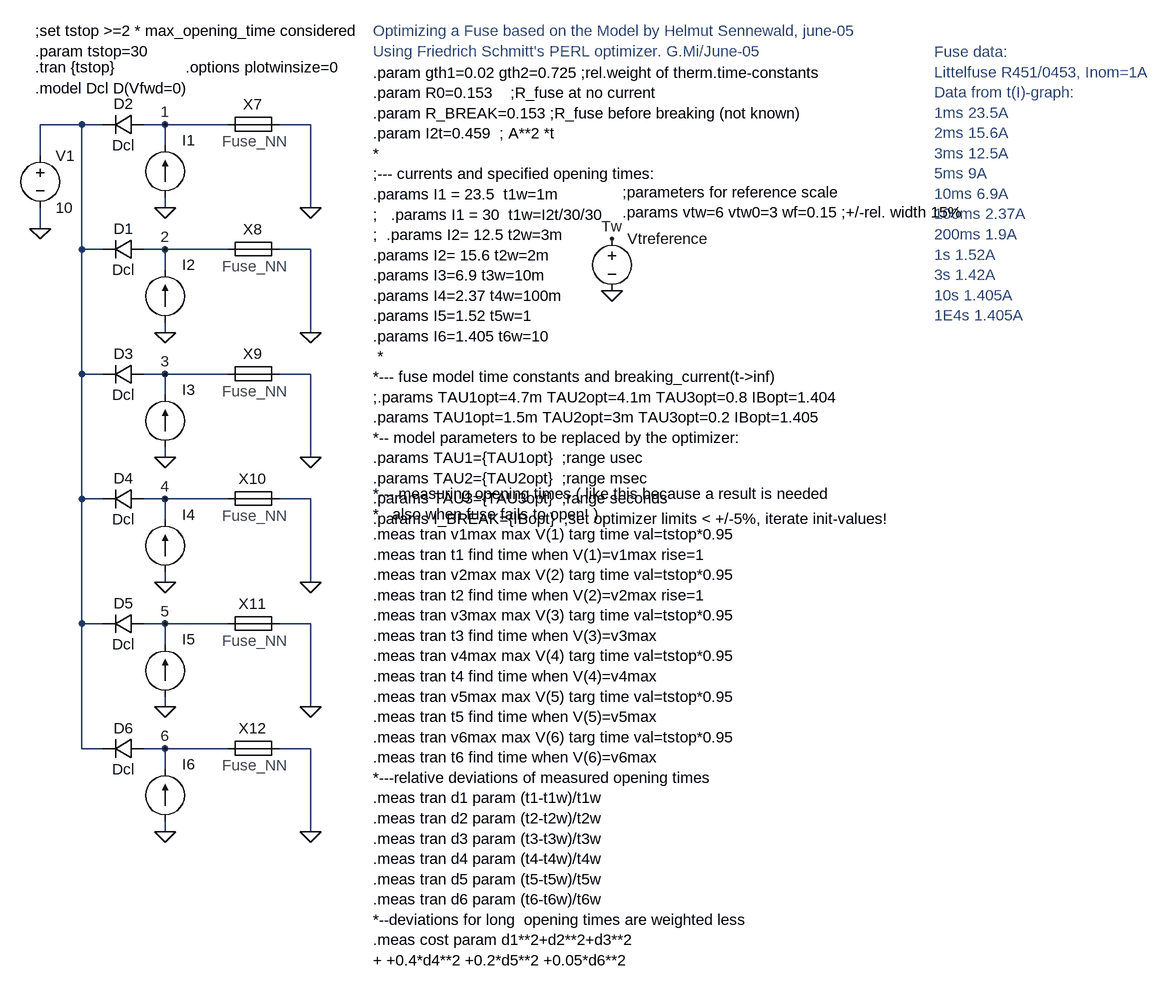
[diagram p0: schematic Fuse_FIT.asc]
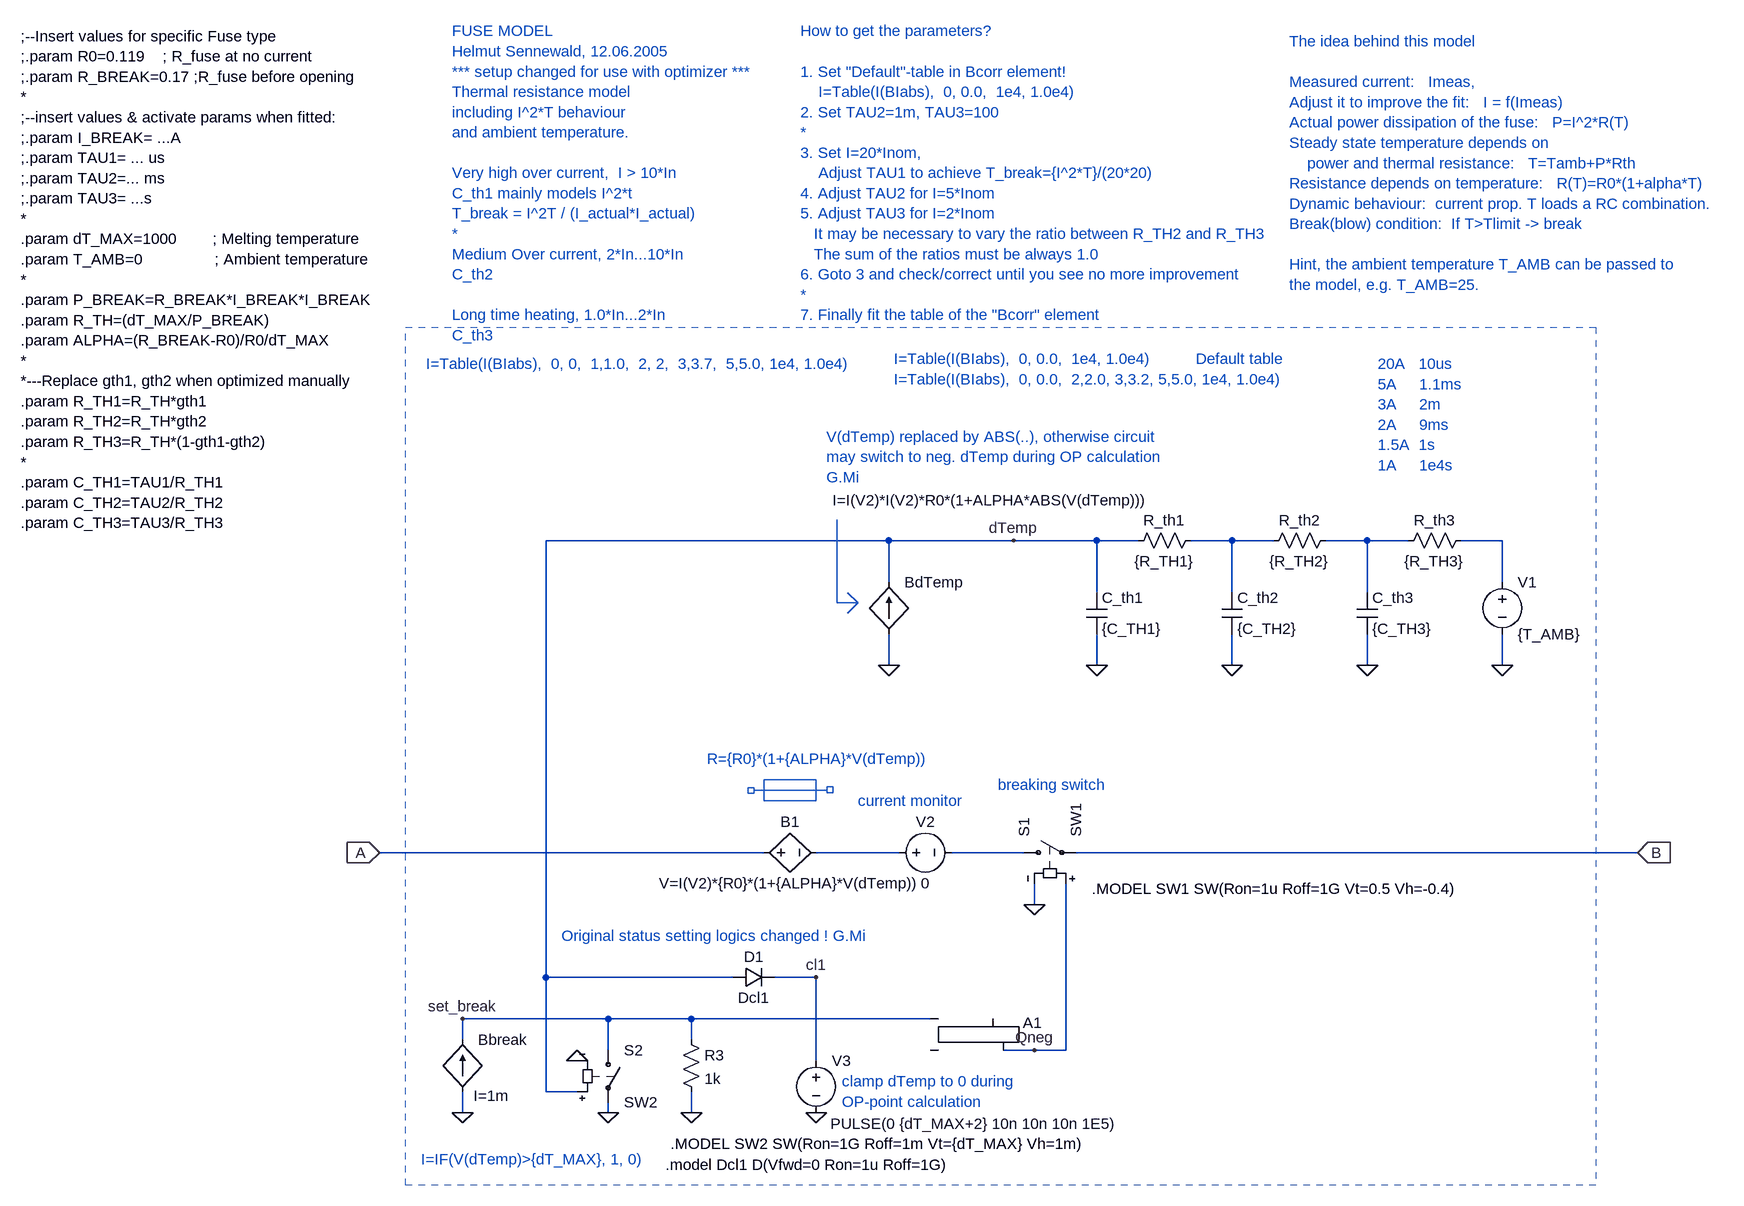
[diagram p1: sub-circuit fuse_model_nn.asc]
Fuse_FIT.asc, the LTspice schematic file:
Version 4
SHEET 1 3648 932
WIRE -384 -752 -448 -752
WIRE -352 -752 -384 -752
WIRE -256 -752 -288 -752
WIRE -160 -752 -256 -752
WIRE -32 -752 -80 -752
WIRE -256 -720 -256 -752
WIRE -448 -704 -448 -752
WIRE -256 -624 -256 -640
WIRE -32 -624 -32 -752
WIRE -448 -592 -448 -624
WIRE -384 -560 -384 -752
WIRE -352 -560 -384 -560
WIRE -256 -560 -288 -560
WIRE -160 -560 -256 -560
WIRE -32 -560 -80 -560
WIRE -256 -528 -256 -560
WIRE -256 -432 -256 -448
WIRE -32 -432 -32 -560
WIRE -384 -368 -384 -560
WIRE -352 -368 -384 -368
WIRE -256 -368 -288 -368
WIRE -160 -368 -256 -368
WIRE -32 -368 -80 -368
WIRE -256 -336 -256 -368
WIRE -256 -240 -256 -256
WIRE -32 -240 -32 -368
WIRE -384 -176 -384 -368
WIRE -352 -176 -384 -176
WIRE -256 -176 -288 -176
WIRE -160 -176 -256 -176
WIRE -32 -176 -80 -176
WIRE -256 -144 -256 -176
WIRE -256 -48 -256 -64
WIRE -32 -48 -32 -176
WIRE -384 16 -384 -176
WIRE -352 16 -384 16
WIRE -256 16 -288 16
WIRE -160 16 -256 16
WIRE -32 16 -80 16
WIRE -256 48 -256 16
WIRE -256 144 -256 128
WIRE -32 144 -32 16
WIRE -384 208 -384 16
WIRE -352 208 -384 208
WIRE -256 208 -288 208
WIRE -160 208 -256 208
WIRE -32 208 -80 208
WIRE -256 240 -256 208
WIRE -256 336 -256 320
WIRE -32 336 -32 208
FLAG -256 -624 0
FLAG -256 -752 1
FLAG -32 -624 0
FLAG -448 -592 0
FLAG -256 -432 0
FLAG -256 -560 2
FLAG -32 -432 0
FLAG -256 -240 0
FLAG -256 -368 3
FLAG -32 -240 0
FLAG -256 -48 0
FLAG -256 -176 4
FLAG -32 -48 0
FLAG -256 144 0
FLAG -256 16 5
FLAG -32 144 0
FLAG -256 336 0
FLAG -256 208 6
FLAG -32 336 0
FLAG 432 -496 0
FLAG 432 -576 Tw
SYMBOL diode -288 -768 R90
WINDOW 0 0 32 VBottom 0
WINDOW 3 32 32 VTop 0
SYMATTR InstName D2
SYMATTR Value Dcl
SYMBOL voltage -448 -720 R0
WINDOW 123 0 0 Left 0
WINDOW 39 0 0 Left 0
SYMATTR InstName V1
SYMATTR Value 10
SYMBOL Fuse_Model_NN -128 -752 R0
SYMATTR InstName X7
SYMBOL Fuse_Model_NN -128 -560 R0
SYMATTR InstName X8
SYMBOL Fuse_Model_NN -128 -368 R0
SYMATTR InstName X9
SYMBOL Fuse_Model_NN -128 -176 R0
SYMATTR InstName X10
SYMBOL Fuse_Model_NN -128 16 R0
SYMATTR InstName X11
SYMBOL Fuse_Model_NN -128 208 R0
SYMATTR InstName X12
SYMBOL diode -288 -576 R90
WINDOW 0 0 32 VBottom 0
WINDOW 3 32 32 VTop 0
SYMATTR InstName D1
SYMATTR Value Dcl
SYMBOL diode -288 -384 R90
WINDOW 0 0 32 VBottom 0
WINDOW 3 32 32 VTop 0
SYMATTR InstName D3
SYMATTR Value Dcl
SYMBOL diode -288 -192 R90
WINDOW 0 0 32 VBottom 0
WINDOW 3 32 32 VTop 0
SYMATTR InstName D4
SYMATTR Value Dcl
SYMBOL diode -288 0 R90
WINDOW 0 0 32 VBottom 0
WINDOW 3 32 32 VTop 0
SYMATTR InstName D5
SYMATTR Value Dcl
SYMBOL diode -288 192 R90
WINDOW 0 0 32 VBottom 0
WINDOW 3 32 32 VTop 0
SYMATTR InstName D6
SYMATTR Value Dcl
SYMBOL voltage 432 -592 R0
WINDOW 3 26 87 Invisible 0
WINDOW 123 0 0 Left 0
WINDOW 39 0 0 Left 0
SYMATTR Value PWL(0 {vtw0} {t1w-t1w*wf} {vtw0} {t1w} {vtw} {t1w+t1w*wf} {vtw0} {t2w-t2w*wf} {vtw0} {t2w} {vtw} {t2w+t2w*wf} {vtw0} {t3w-t3w*wf} {vtw0} {t3w} {vtw} {t3w+t3w*wf} {vtw0} {t4w-t4w*wf} {vtw0} {t4w} {vtw} {t4w+t4w*wf} {vtw0} {t5w-t5w*wf} {vtw0} {t5w} {vtw} {t5w+t5w*wf} {vtw0} {t6w-t6w*wf} {vtw0} {t6w} {vtw} {t6w+t6w*wf} {vtw0})
SYMATTR InstName Vtreference
SYMBOL current -256 -448 R180
WINDOW 0 -47 88 Left 0
WINDOW 3 -82 39 Invisible 0
WINDOW 123 0 0 Left 0
WINDOW 39 0 0 Left 0
SYMATTR InstName I2
SYMATTR Value {I2}
SYMBOL current -256 -256 R180
WINDOW 0 -47 88 Left 0
WINDOW 3 -82 39 Invisible 0
WINDOW 123 0 0 Left 0
WINDOW 39 0 0 Left 0
SYMATTR InstName I3
SYMATTR Value {I3}
SYMBOL current -256 -64 R180
WINDOW 0 -47 88 Left 0
WINDOW 3 -82 39 Invisible 0
WINDOW 123 0 0 Left 0
WINDOW 39 0 0 Left 0
SYMATTR InstName I4
SYMATTR Value {I4}
SYMBOL current -256 128 R180
WINDOW 0 -47 88 Left 0
WINDOW 3 -82 39 Invisible 0
WINDOW 123 0 0 Left 0
WINDOW 39 0 0 Left 0
SYMATTR InstName I5
SYMATTR Value {I5}
SYMBOL current -256 320 R180
WINDOW 0 -47 88 Left 0
WINDOW 3 -82 39 Invisible 0
WINDOW 123 0 0 Left 0
WINDOW 39 0 0 Left 0
SYMATTR InstName I6
SYMATTR Value PULSE(0 {I6} 0 1n 1n 1E6)
SYMBOL current -256 -640 R180
WINDOW 0 -47 88 Left 0
WINDOW 3 -82 39 Invisible 0
WINDOW 123 0 0 Left 0
WINDOW 39 0 0 Left 0
SYMATTR InstName I1
SYMATTR Value {I1}
TEXT -456 -840 Left 0 !.tran {tstop}
TEXT -224 -840 Left 0 !.options plotwinsize=0
TEXT 64 -832 Left 0 !.param gth1=0.02 gth2=0.725 ;rel.weight of therm.time-constants\n.param R0=0.153    ;R_fuse at no current\n.param R_BREAK=0.153 ;R_fuse before breaking (not known)\n.param I2t=0.459  ; A**2 *t\n*\n;--- currents and specified opening times:\n.params I1 = 23.5  t1w=1m\n;   .params I1 = 30  t1w=I2t/30/30\n;  .params I2= 12.5 t2w=3m\n.params I2= 15.6 t2w=2m\n.params I3=6.9 t3w=10m\n.params I4=2.37 t4w=100m\n.params I5=1.52 t5w=1\n.params I6=1.405 t6w=10\n *\n*--- fuse model time constants and breaking_current(t->inf)\n;.params TAU1opt=4.7m TAU2opt=4.1m TAU3opt=0.8 IBopt=1.404\n.params TAU1opt=1.5m TAU2opt=3m TAU3opt=0.2 IBopt=1.405\n*-- model parameters to be replaced by the optimizer:\n.params TAU1={TAU1opt}  ;range usec\n.params TAU2={TAU2opt}  ;range msec\n.params TAU3={TAU3opt}  ;range seconds\n.params I_BREAK={IBopt}  ;set optimizer limits < +/-5%, iterate init-values!
TEXT 64 -184 Left 0 !*--- measuring opening times ( like this because a result is needed\n*   also when fuse fails to open! )\n.meas tran v1max max V(1) targ time val=tstop*0.95\n.meas tran t1 find time when V(1)=v1max rise=1\n.meas tran v2max max V(2) targ time val=tstop*0.95\n.meas tran t2 find time when V(2)=v2max rise=1\n.meas tran v3max max V(3) targ time val=tstop*0.95\n.meas tran t3 find time when V(3)=v3max\n.meas tran v4max max V(4) targ time val=tstop*0.95\n.meas tran t4 find time when V(4)=v4max\n.meas tran v5max max V(5) targ time val=tstop*0.95\n.meas tran t5 find time when V(5)=v5max\n.meas tran v6max max V(6) targ time val=tstop*0.95\n.meas tran t6 find time when V(6)=v6max\n*---relative deviations of measured opening times\n.meas tran d1 param (t1-t1w)/t1w\n.meas tran d2 param (t2-t2w)/t2w\n.meas tran d3 param (t3-t3w)/t3w\n.meas tran d4 param (t4-t4w)/t4w\n.meas tran d5 param (t5-t5w)/t5w\n.meas tran d6 param (t6-t6w)/t6w\n*--deviations for long  opening times are weighted less\n.meas cost param d1**2+d2**2+d3**2\n+ +0.4*d4**2 +0.2*d5**2 +0.05*d6**2
TEXT -456 -808 Left 0 !.model Dcl D(Vfwd=0)
TEXT -456 -896 Left 0 !;set tstop >=2 * max_opening_time considered\n.param tstop=30
TEXT 928 -864 Left 0 ;Fuse data:\nLittelfuse R451/0453, Inom=1A\nData from t(I)-graph:\n1ms 23.5A\n2ms 15.6A\n3ms 12.5A\n5ms 9A\n10ms 6.9A\n100ms 2.37A\n200ms 1.9A\n1s 1.52A\n3s 1.42A\n10s 1.405A\n1E4s 1.405A
TEXT 64 -896 Left 0 ;Optimizing a Fuse based on the Model by Helmut Sennewald, june-05\nUsing Friedrich Schmitt's PERL optimizer. G.Mi/June-05
TEXT 448 -648 Left 0 !;parameters for reference scale\n.params vtw=6 vtw0=3 wf=0.15 ;+/-rel. width 15%

fuse_model_nn.asc, the sub-circuit schematic file:
Version 4
SHEET 1 2036 932
WIRE -96 368 -96 336
WIRE -96 480 -96 448
WIRE 32 272 32 -400
WIRE 32 448 32 272
WIRE 80 448 32 448
WIRE 128 336 -96 336
WIRE 128 384 128 336
WIRE 128 480 128 464
WIRE 256 336 128 336
WIRE 256 368 256 336
WIRE 256 480 256 448
WIRE 320 272 32 272
WIRE 368 80 -224 80
WIRE 448 272 384 272
WIRE 448 400 448 272
WIRE 560 -400 32 -400
WIRE 560 -336 560 -400
WIRE 560 -208 560 -256
WIRE 576 80 448 80
WIRE 624 336 256 336
WIRE 752 -400 560 -400
WIRE 768 80 656 80
WIRE 784 160 784 128
WIRE 784 384 736 384
WIRE 832 384 784 384
WIRE 832 384 832 128
WIRE 880 -400 752 -400
WIRE 880 -320 880 -400
WIRE 880 -208 880 -256
WIRE 944 -400 880 -400
WIRE 1088 -400 1024 -400
WIRE 1088 -320 1088 -400
WIRE 1088 -208 1088 -256
WIRE 1152 -400 1088 -400
WIRE 1296 -400 1232 -400
WIRE 1296 -320 1296 -400
WIRE 1296 -208 1296 -256
WIRE 1360 -400 1296 -400
WIRE 1504 -400 1440 -400
WIRE 1504 -336 1504 -400
WIRE 1504 -208 1504 -256
WIRE 1712 80 848 80
FLAG 560 -208 0
FLAG 784 160 0
FLAG 752 -400 dTemp
FLAG 880 -208 0
FLAG 1296 -208 0
FLAG 1088 -208 0
FLAG -96 480 0
FLAG 256 480 0
FLAG -96 336 set_break
FLAG 1504 -208 0
FLAG -224 80 A
IOPIN -224 80 In
FLAG 1712 80 B
IOPIN 1712 80 In
FLAG 784 384 Qneg
FLAG 128 480 0
FLAG 448 480 0
FLAG 80 400 0
FLAG 448 272 cl1
SYMBOL voltage 560 80 R270
WINDOW 0 32 56 VTop 0
WINDOW 3 -32 56 VBottom 0
SYMATTR InstName V2
SYMATTR Value 0
SYMBOL bi2 560 -336 R0
WINDOW 3 -87 -126 Left 0
SYMATTR Value I=I(V2)*I(V2)*R0*(1+ALPHA*ABS(V(dTemp)))
SYMATTR InstName BdTemp
SYMBOL res 928 -384 R270
WINDOW 0 32 56 VTop 0
WINDOW 3 0 56 VBottom 0
SYMATTR InstName R_th1
SYMATTR Value {R_TH1}
SYMBOL cap 864 -320 R0
SYMATTR InstName C_th1
SYMATTR Value {C_TH1}
SYMBOL sw 752 80 R270
SYMATTR InstName S1
SYMATTR Value SW1
SYMBOL res 1136 -384 R270
WINDOW 0 32 56 VTop 0
WINDOW 3 0 56 VBottom 0
SYMATTR InstName R_th2
SYMATTR Value {R_TH2}
SYMBOL cap 1072 -320 R0
SYMATTR InstName C_th2
SYMATTR Value {C_TH2}
SYMBOL Digital\\srflop 672 288 R0
SYMATTR InstName A1
SYMBOL cap 1280 -320 R0
SYMATTR InstName C_th3
SYMATTR Value {C_TH3}
SYMBOL bi2 -96 368 R0
WINDOW 3 17 86 Left 0
SYMATTR Value I=1m
SYMATTR InstName Bbreak
SYMBOL res 240 352 R0
SYMATTR InstName R3
SYMATTR Value 1k
SYMBOL res 1344 -384 R270
WINDOW 0 32 56 VTop 0
WINDOW 3 0 56 VBottom 0
SYMATTR InstName R_th3
SYMATTR Value {R_TH3}
SYMBOL bv 352 80 R270
WINDOW 0 32 56 VTop 0
WINDOW 3 -32 56 VBottom 0
SYMATTR InstName B1
SYMATTR Value V=I(V2)*{R0}*(1+{ALPHA}*V(dTemp))
SYMBOL voltage 1504 -352 R0
SYMATTR InstName V1
SYMATTR Value {T_AMB}
SYMBOL sw 128 368 R0
SYMATTR InstName S2
SYMATTR Value SW2
SYMBOL voltage 448 384 R0
WINDOW 123 0 0 Left 0
WINDOW 39 0 0 Left 0
WINDOW 3 22 113 Left 0
SYMATTR Value PULSE(0 {dT_MAX+2} 10n 10n 10n 1E5)
SYMATTR InstName V3
SYMBOL diode 320 288 R270
WINDOW 0 32 32 VTop 0
WINDOW 3 0 32 VBottom 0
SYMATTR InstName D1
SYMATTR Value Dcl1
TEXT 872 136 Left 0 !.MODEL SW1 SW(Ron=1u Roff=1G Vt=0.5 Vh=-0.4)
TEXT -112 -1184 Left 0 ;FUSE MODEL\nHelmut Sennewald, 12.06.2005\n*** setup changed for use with optimizer ***\nThermal resistance model \nincluding I^2*T behaviour \nand ambient temperature.\n \nVery high over current,  I > 10*In\nC_th1 mainly models I^2*t \nT_break = I^2T / (I_actual*I_actual)\n*\nMedium Over current, 2*In...10*In\nC_th2 \n \nLong time heating, 1.0*In...2*In\nC_th3
TEXT 568 -648 Left 0 ;I=Table(I(BIabs),  0, 0.0,  2,2.0, 3,3.2, 5,5.0, 1e4, 1.0e4)
TEXT 568 -680 Left 0 ;I=Table(I(BIabs),  0, 0.0,  1e4, 1.0e4)
TEXT 1032 -680 Left 0 ;Default table
TEXT 280 -64 Left 0 ;R={R0}*(1+{ALPHA}*V(dTemp))
TEXT 512 0 Left 0 ;current monitor
TEXT 728 -24 Left 0 ;breaking switch
TEXT 424 -1184 Left 0 ;How to get the parameters?\n \n1. Set "Default"-table in Bcorr element!\n    I=Table(I(BIabs),  0, 0.0,  1e4, 1.0e4)\n2. Set TAU2=1m, TAU3=100\n*\n3. Set I=20*Inom, \n    Adjust TAU1 to achieve T_break={I^2*T}/(20*20)\n4. Adjust TAU2 for I=5*Inom\n5. Adjust TAU3 for I=2*Inom\n   It may be necessary to vary the ratio between R_TH2 and R_TH3\n   The sum of the ratios must be always 1.0\n6. Goto 3 and check/correct until you see no more improvement\n*\n7. Finally fit the table of the "Bcorr" element
TEXT -776 -1176 Left 0 !;--Insert values for specific Fuse type\n;.param R0=0.119    ; R_fuse at no current\n;.param R_BREAK=0.17 ;R_fuse before opening\n*\n;--insert values & activate params when fitted:\n;.param I_BREAK= ...A\n;.param TAU1= ... us\n;.param TAU2=... ms\n;.param TAU3= ...s\n*\n.param dT_MAX=1000        ; Melting temperature\n.param T_AMB=0                ; Ambient temperature\n*\n.param P_BREAK=R_BREAK*I_BREAK*I_BREAK\n.param R_TH=(dT_MAX/P_BREAK)\n.param ALPHA=(R_BREAK-R0)/R0/dT_MAX\n*\n*---Replace gth1, gth2 when optimized manually\n.param R_TH1=R_TH*gth1\n.param R_TH2=R_TH*gth2\n.param R_TH3=R_TH*(1-gth1-gth2)\n*\n.param C_TH1=TAU1/R_TH1\n.param C_TH2=TAU2/R_TH2\n.param C_TH3=TAU3/R_TH3
TEXT -152 -672 Left 0 ;I=Table(I(BIabs),  0, 0,  1,1.0,  2, 2,  3,3.7,  5,5.0, 1e4, 1.0e4)
TEXT 1312 -672 Left 0 ;20A   10us\n5A     1.1ms\n3A     2m\n2A     9ms\n1.5A  1s\n1A     1e4s
TEXT 1176 -1168 Left 0 ;The idea behind this model\n \nMeasured current:   Imeas,       \nAdjust it to improve the fit:   I = f(Imeas)      \nActual power dissipation of the fuse:   P=I^2*R(T) \nSteady state temperature depends on \n    power and thermal resistance:   T=Tamb+P*Rth    \nResistance depends on temperature:   R(T)=R0*(1+alpha*T)   \nDynamic behaviour:  current prop. T loads a RC combination. \nBreak(blow) condition:  If T>Tlimit -> break\n \nHint, the ambient temperature T_AMB can be passed to\nthe model, e.g. T_AMB=25.
TEXT -160 552 Left 0 ;I=IF(V(dTemp)>{dT_MAX}, 1, 0)
TEXT 224 528 Left 0 !.MODEL SW2 SW(Ron=1G Roff=1m Vt={dT_MAX} Vh=1m)
TEXT 216 560 Left 0 !.model Dcl1 D(Vfwd=0 Ron=1u Roff=1G)
TEXT 488 432 Left 0 ;clamp dTemp to 0 during\nOP-point calculation
TEXT 56 208 Left 0 ;Original status setting logics changed ! G.Mi
TEXT 464 -560 Left 0 ;V(dTemp) replaced by ABS(..), otherwise circuit\nmay switch to neg. dTemp during OP calculation\nG.Mi
LINE Normal 480 -432 480 -432
LINE Normal 480 -304 480 -432
LINE Normal 512 -304 480 -304
LINE Normal 496 -320 512 -304
LINE Normal 496 -288 512 -304
LINE Normal 464 -16 352 -16
RECTANGLE Normal 1648 592 -184 -728 2
RECTANGLE Normal 448 0 368 -32
RECTANGLE Normal 474 -12 465 -21
RECTANGLE Normal 352 -11 343 -20

The netlist it stands for:
* Fuse_FIT.asc
D2 1 N001 Dcl
V1 N001 0 10
XX7 1 0 fuse_model_nn
XX8 2 0 fuse_model_nn
XX9 3 0 fuse_model_nn
XX10 4 0 fuse_model_nn
XX11 5 0 fuse_model_nn
XX12 6 0 fuse_model_nn
D1 2 N001 Dcl
D3 3 N001 Dcl
D4 4 N001 Dcl
D5 5 N001 Dcl
D6 6 N001 Dcl
Vtreference Tw 0 PWL(0 {vtw0} {t1w-t1w*wf} {vtw0} {t1w} {vtw} {t1w+t1w*wf} {vtw0} {t2w-t2w*wf} {vtw0} {t2w} {vtw} {t2w+t2w*wf} {vtw0} {t3w-t3w*wf} {vtw0} {t3w} {vtw} {t3w+t3w*wf} {vtw0} {t4w-t4w*wf} {vtw0} {t4w} {vtw} {t4w+t4w*wf} {vtw0} {t5w-t5w*wf} {vtw0} {t5w} {vtw} {t5w+t5w*wf} {vtw0} {t6w-t6w*wf} {vtw0} {t6w} {vtw} {t6w+t6w*wf} {vtw0})
I2 0 2 {I2}
I3 0 3 {I3}
I4 0 4 {I4}
I5 0 5 {I5}
I6 0 6 PULSE(0 {I6} 0 1n 1n 1E6)
I1 0 1 {I1}

* block symbol definitions
.subckt fuse_model_nn A B
V2 N001 N002 0
BdTemp 0 dTemp I=I(V2)*I(V2)*R0*(1+ALPHA*ABS(V(dTemp)))
R_th1 dTemp N003 {R_TH1}
C_th1 dTemp 0 {C_TH1}
S1 N002 B Qneg 0 SW1
R_th2 N003 N004 {R_TH2}
C_th2 N003 0 {C_TH2}
A1 set_break 0 0 0 0 Qneg 0 0 SRFLOP
C_th3 N004 0 {C_TH3}
Bbreak 0 set_break I=1m
R3 set_break 0 1k
R_th3 N004 N005 {R_TH3}
B1 A N001 V=I(V2)*{R0}*(1+{ALPHA}*V(dTemp))
V1 N005 0 {T_AMB}
S2 set_break 0 dTemp 0 SW2
V3 cl1 0 PULSE(0 {dT_MAX+2} 10n 10n 10n 1E5)
D1 dTemp cl1 Dcl1
.MODEL SW1 SW(Ron=1u Roff=1G Vt=0.5 Vh=-0.4)
* FUSE MODEL
* Helmut Sennewald, 12.06.2005
* *** setup changed for use with optimizer ***
* Thermal resistance model
* including I^2*T behaviour
* and ambient temperature.
* Very high over current,  I > 10*In
* C_th1 mainly models I^2*t
* T_break = I^2T / (I_actual*I_actual)
* *
* Medium Over current, 2*In...10*In
* C_th2
* Long time heating, 1.0*In...2*In
* C_th3
* I=Table(I(BIabs),  0, 0.0,  2,2.0, 3,3.2, 5,5.0, 1e4, 1.0e4)
* I=Table(I(BIabs),  0, 0.0,  1e4, 1.0e4)
* Default table
* R={R0}*(1+{ALPHA}*V(dTemp))
* current monitor
* breaking switch
* How to get the parameters?
* 1. Set "Default"-table in Bcorr element!
*     I=Table(I(BIabs),  0, 0.0,  1e4, 1.0e4)
* 2. Set TAU2=1m, TAU3=100
* *
* 3. Set I=20*Inom,
*     Adjust TAU1 to achieve T_break={I^2*T}/(20*20)
* 4. Adjust TAU2 for I=5*Inom
* 5. Adjust TAU3 for I=2*Inom
*    It may be necessary to vary the ratio between R_TH2 and R_TH3
*    The sum of the ratios must be always 1.0
* 6. Goto 3 and check/correct until you see no more improvement
* *
* 7. Finally fit the table of the "Bcorr" element
;--Insert values for specific Fuse type
;.param R0=0.119    ; R_fuse at no current
;.param R_BREAK=0.17 ;R_fuse before opening
*
;--insert values & activate params when fitted:
;.param I_BREAK= ...A
;.param TAU1= ... us
;.param TAU2=... ms
;.param TAU3= ...s
*
.param dT_MAX=1000        ; Melting temperature
.param T_AMB=0                ; Ambient temperature
*
.param P_BREAK=R_BREAK*I_BREAK*I_BREAK
.param R_TH=(dT_MAX/P_BREAK)
.param ALPHA=(R_BREAK-R0)/R0/dT_MAX
*
*---Replace gth1, gth2 when optimized manually
.param R_TH1=R_TH*gth1
.param R_TH2=R_TH*gth2
.param R_TH3=R_TH*(1-gth1-gth2)
*
.param C_TH1=TAU1/R_TH1
.param C_TH2=TAU2/R_TH2
.param C_TH3=TAU3/R_TH3
* I=Table(I(BIabs),  0, 0,  1,1.0,  2, 2,  3,3.7,  5,5.0, 1e4, 1.0e4)
* 20A   10us
* 5A     1.1ms
* 3A     2m
* 2A     9ms
* 1.5A  1s
* 1A     1e4s
* The idea behind this model
* Measured current:   Imeas,
* Adjust it to improve the fit:   I = f(Imeas)
* Actual power dissipation of the fuse:   P=I^2*R(T)
* Steady state temperature depends on
*     power and thermal resistance:   T=Tamb+P*Rth
* Resistance depends on temperature:   R(T)=R0*(1+alpha*T)
* Dynamic behaviour:  current prop. T loads a RC combination.
* Break(blow) condition:  If T>Tlimit -> break
* Hint, the ambient temperature T_AMB can be passed to
* the model, e.g. T_AMB=25.
* I=IF(V(dTemp)>{dT_MAX}, 1, 0)
.MODEL SW2 SW(Ron=1G Roff=1m Vt={dT_MAX} Vh=1m)
.model Dcl1 D(Vfwd=0 Ron=1u Roff=1G)
* clamp dTemp to 0 during
* OP-point calculation
* Original status setting logics changed ! G.Mi
* V(dTemp) replaced by ABS(..), otherwise circuit
* may switch to neg. dTemp during OP calculation
* G.Mi
.ends fuse_model_nn

.model D D
.lib standard.dio
.tran {tstop}
.options plotwinsize=0
.param gth1=0.02 gth2=0.725 ;rel.weight of therm.time-constants
.param R0=0.153    ;R_fuse at no current
.param R_BREAK=0.153 ;R_fuse before breaking (not known)
.param I2t=0.459  ; A**2 *t
*
;--- currents and specified opening times:
.params I1 = 23.5  t1w=1m
;   .params I1 = 30  t1w=I2t/30/30
;  .params I2= 12.5 t2w=3m
.params I2= 15.6 t2w=2m
.params I3=6.9 t3w=10m
.params I4=2.37 t4w=100m
.params I5=1.52 t5w=1
.params I6=1.405 t6w=10
 *
*--- fuse model time constants and breaking_current(t->inf)
;.params TAU1opt=4.7m TAU2opt=4.1m TAU3opt=0.8 IBopt=1.404
.params TAU1opt=1.5m TAU2opt=3m TAU3opt=0.2 IBopt=1.405
*-- model parameters to be replaced by the optimizer:
.params TAU1={TAU1opt}  ;range usec
.params TAU2={TAU2opt}  ;range msec
.params TAU3={TAU3opt}  ;range seconds
.params I_BREAK={IBopt}  ;set optimizer limits < +/-5%, iterate init-values!
*--- measuring opening times ( like this because a result is needed
*   also when fuse fails to open! )
.meas tran v1max max V(1) targ time val=tstop*0.95
.meas tran t1 find time when V(1)=v1max rise=1
.meas tran v2max max V(2) targ time val=tstop*0.95
.meas tran t2 find time when V(2)=v2max rise=1
.meas tran v3max max V(3) targ time val=tstop*0.95
.meas tran t3 find time when V(3)=v3max
.meas tran v4max max V(4) targ time val=tstop*0.95
.meas tran t4 find time when V(4)=v4max
.meas tran v5max max V(5) targ time val=tstop*0.95
.meas tran t5 find time when V(5)=v5max
.meas tran v6max max V(6) targ time val=tstop*0.95
.meas tran t6 find time when V(6)=v6max
*---relative deviations of measured opening times
.meas tran d1 param (t1-t1w)/t1w
.meas tran d2 param (t2-t2w)/t2w
.meas tran d3 param (t3-t3w)/t3w
.meas tran d4 param (t4-t4w)/t4w
.meas tran d5 param (t5-t5w)/t5w
.meas tran d6 param (t6-t6w)/t6w
*--deviations for long  opening times are weighted less
.meas cost param d1**2+d2**2+d3**2
+ +0.4*d4**2 +0.2*d5**2 +0.05*d6**2
.model Dcl D(Vfwd=0)
;set tstop >=2 * max_opening_time considered
.param tstop=30
* Fuse data:
* Littelfuse R451/0453, Inom=1A
* Data from t(I)-graph:
* 1ms 23.5A
* 2ms 15.6A
* 3ms 12.5A
* 5ms 9A
* 10ms 6.9A
* 100ms 2.37A
* 200ms 1.9A
* 1s 1.52A
* 3s 1.42A
* 10s 1.405A
* 1E4s 1.405A
* Optimizing a Fuse based on the Model by Helmut Sennewald, june-05
* Using Friedrich Schmitt's PERL optimizer. G.Mi/June-05
;parameters for reference scale
.params vtw=6 vtw0=3 wf=0.15 ;+/-rel. width 15%
.backanno
.end